# EAGLE schematic 503_outin_ichigojam (EAGLE 7.6.0)
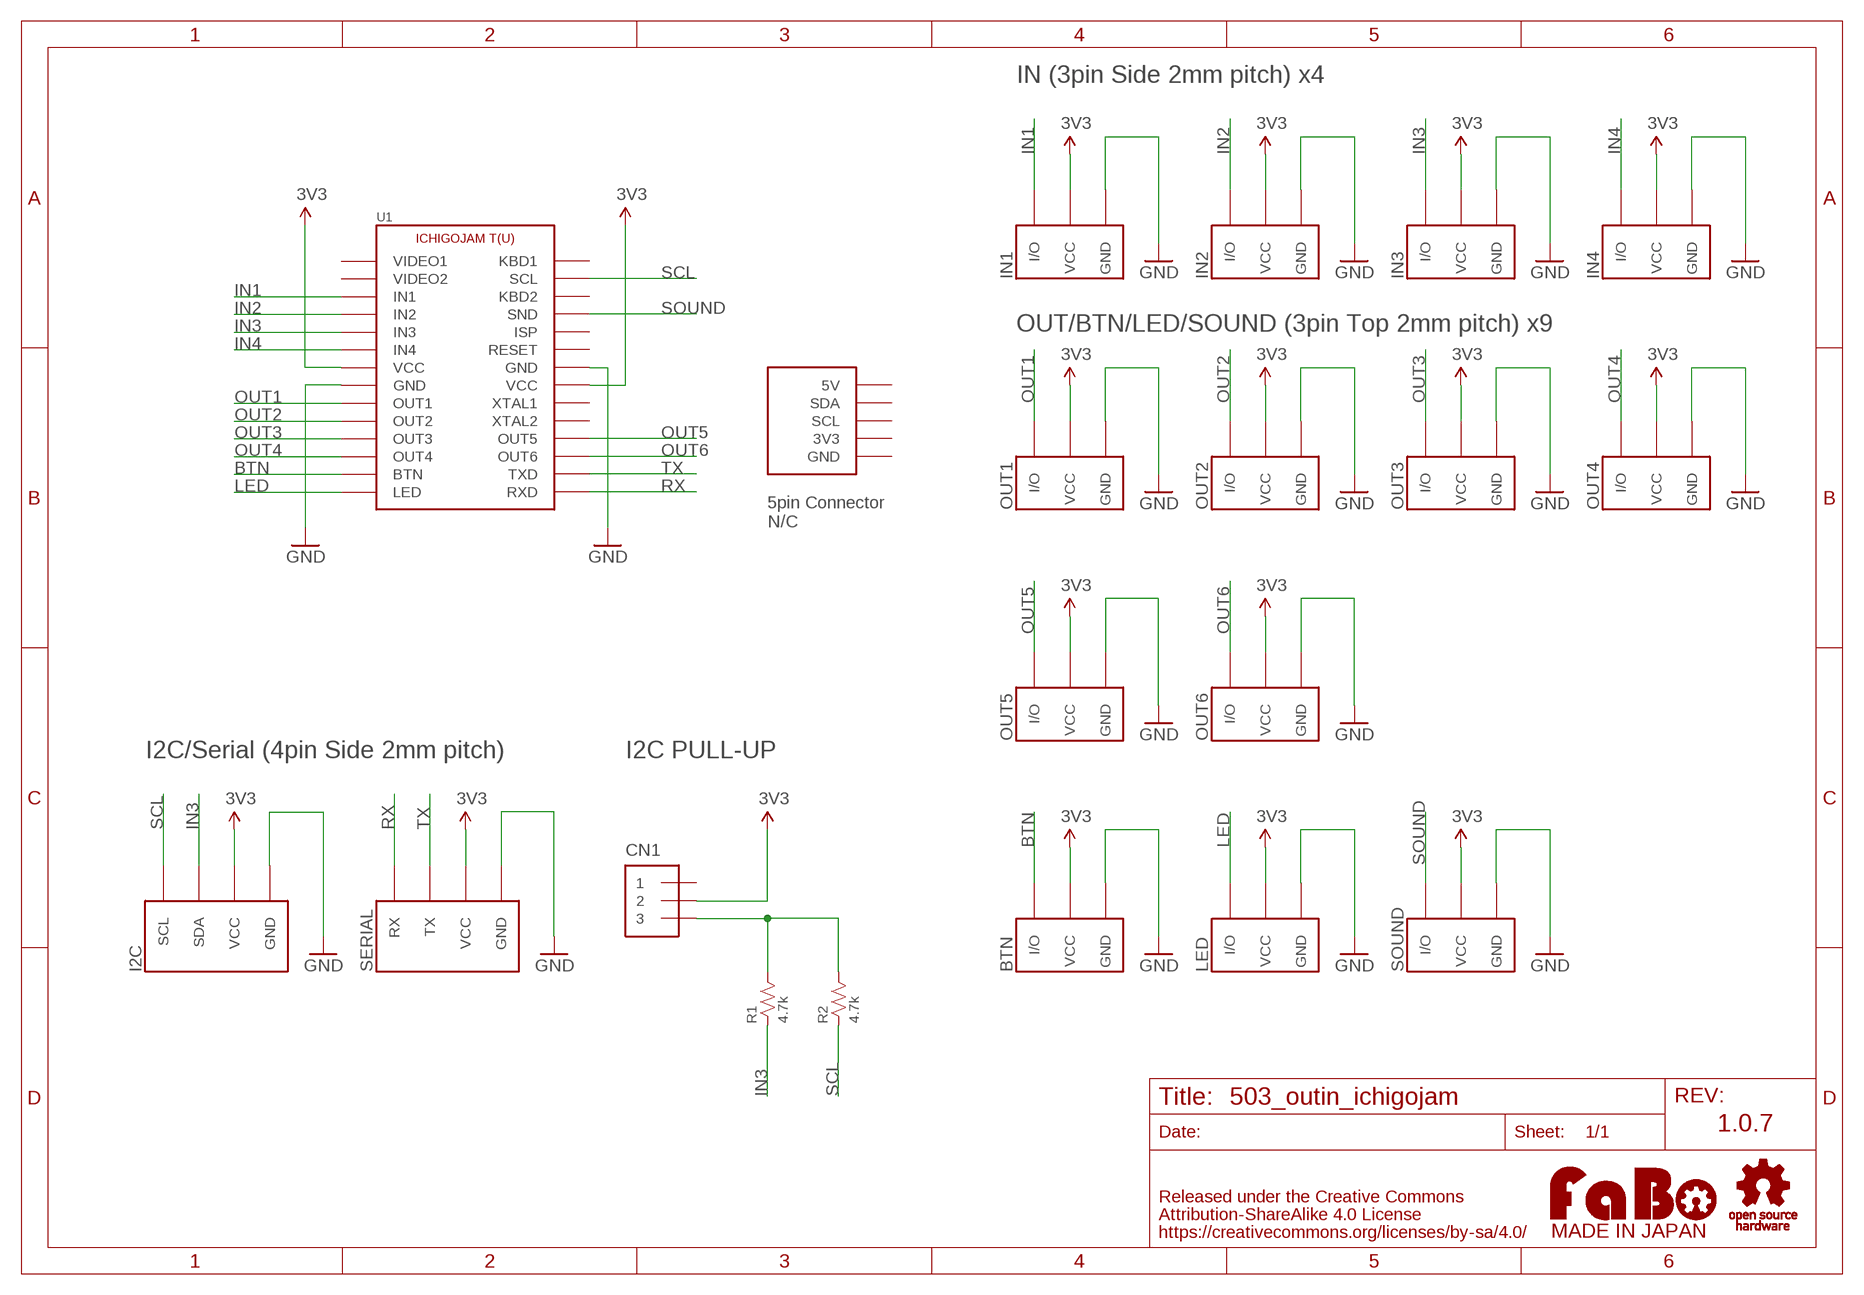
[diagram p0: schematic, sheet 1]

## Parts
BTN  FABO_BRICK_3PIN-B03B-PASK-1  [FABO_BRICK_3PIN_B03B-PASK-1]
CN1  PIN_HEADER_1X3  [PIN_1X3]
I2C  FABO_BRICK_I2C-S04B-PASK-2_LONG  [FABO_BRICK_I2C_S04B-PASK-2_LONG]
IN1  FABO_BRICK_3PIN-S03B-PASK-2_LONG  [FABO_BRICK_3PIN_S03B-PASK-2_LONG]
IN2  FABO_BRICK_3PIN-S03B-PASK-2_LONG  [FABO_BRICK_3PIN_S03B-PASK-2_LONG]
IN3  FABO_BRICK_3PIN-S03B-PASK-2_LONG  [FABO_BRICK_3PIN_S03B-PASK-2_LONG]
IN4  FABO_BRICK_3PIN-S03B-PASK-2_LONG  [FABO_BRICK_3PIN_S03B-PASK-2_LONG]
LED  FABO_BRICK_3PIN-B03B-PASK-1  [FABO_BRICK_3PIN_B03B-PASK-1]
OUT1  FABO_BRICK_3PIN-B03B-PASK-1  [FABO_BRICK_3PIN_B03B-PASK-1]
OUT2  FABO_BRICK_3PIN-B03B-PASK-1  [FABO_BRICK_3PIN_B03B-PASK-1]
OUT3  FABO_BRICK_3PIN-B03B-PASK-1  [FABO_BRICK_3PIN_B03B-PASK-1]
OUT4  FABO_BRICK_3PIN-B03B-PASK-1  [FABO_BRICK_3PIN_B03B-PASK-1]
OUT5  FABO_BRICK_3PIN-B03B-PASK-1  [FABO_BRICK_3PIN_B03B-PASK-1]
OUT6  FABO_BRICK_3PIN-B03B-PASK-1  [FABO_BRICK_3PIN_B03B-PASK-1]
R1  4.7k  RESISTOR-AXL-REGULAR  [AXL-REGULAR]
R2  4.7k  RESISTOR-AXL-REGULAR  [AXL-REGULAR]
SERIAL  FABO_BRICK_SERIAL-S04B-PASK-2_LONG  [FABO_BRICK_SERIAL_S04B-PASK-2_LONG]
SOUND  FABO_BRICK_3PIN-B03B-PASK-1  [FABO_BRICK_3PIN_B03B-PASK-1]
U1  ICHIGOJAM_T-NOLABEL  [ICHIGOJAM_T_NOLABEL]
U$2  LOGO_OSHW-M_BOTTOM  [LOGO_OSHW_M_BOTTOM]
U$3  LOGO_FABO-M  [LOGO_FABO_MS]

## Nets
3V3: BTN.VCC CN1.2 I2C.VCC IN1.VCC IN2.VCC IN3.VCC IN4.VCC LED.VCC OUT1.VCC OUT2.VCC OUT3.VCC OUT4.VCC OUT5.VCC OUT6.VCC SERIAL.VCC SOUND.VCC U1.VCC1(VCC) U1.VCC2(VCC)
BTN: BTN.I/O U1.BTN
GND: BTN.GND I2C.GND IN1.GND IN2.GND IN3.GND IN4.GND LED.GND OUT1.GND OUT2.GND OUT3.GND OUT4.GND OUT5.GND OUT6.GND SERIAL.GND SOUND.GND U1.GND1(GND) U1.GND2(GND)
IN1: IN1.I/O U1.IN1
IN2: IN2.I/O U1.IN2
IN3: I2C.SDA IN3.I/O R1.1 U1.IN3
IN4: IN4.I/O U1.IN4
LED: LED.I/O U1.LED
N$1: CN1.3 R1.2 R2.2
OUT1: OUT1.I/O U1.OUT1
OUT2: OUT2.I/O U1.OUT2
OUT3: OUT3.I/O U1.OUT3
OUT4: OUT4.I/O U1.OUT4
OUT5: OUT5.I/O U1.OUT5
OUT6: OUT6.I/O U1.OUT6
RX: SERIAL.RX U1.RXD
SCL: I2C.SCL R2.1 U1.SCL1(SCL)
SOUND: SOUND.I/O U1.SND
TX: SERIAL.TX U1.TXD
Unconnected: CN1.1 U1.3V3 U1.5V U1.GND3(GND) U1.ISP U1.KBD1 U1.KBD2 U1.RST(RESET) U1.SCL2(SCL) U1.SDA U1.VIDEO1 U1.VIDEO2 U1.XTAL1 U1.XTAL2

## Notes on the sheet
- IN (3pin Side 2mm pitch) x4
- OUT/BTN/LED/SOUND (3pin Top 2mm pitch) x9
- 5pin Connector
  N/C
- I2C/Serial (4pin Side 2mm pitch) | I2C PULL-UP
- 1.0.7

## Library data of the parts
BTN IN1-IN4 LED OUT1-OUT6 SOUND = FaBo-Template:FABO_BRICK_3PIN: FaBo Brick 3pin
CN1 = FaBo-PIN:PIN_HEADER_1X3
I2C = FaBo-Template:FABO_BRICK_I2C: FaBo Brick I2C
R1 R2 = FaBo-Resistors:RESISTOR: RESISTOR
SERIAL = FaBo-Template:FABO_BRICK_SERIAL: FaBo Brick Serial
U1 = FaBo-Boards:ICHIGOJAM_T
U$2 = FaBo-etc:LOGO_OSHW
U$3 = FaBo-etc:LOGO_FABO